# EAGLE design TSAL_Revisado (EAGLE 9.0.1)
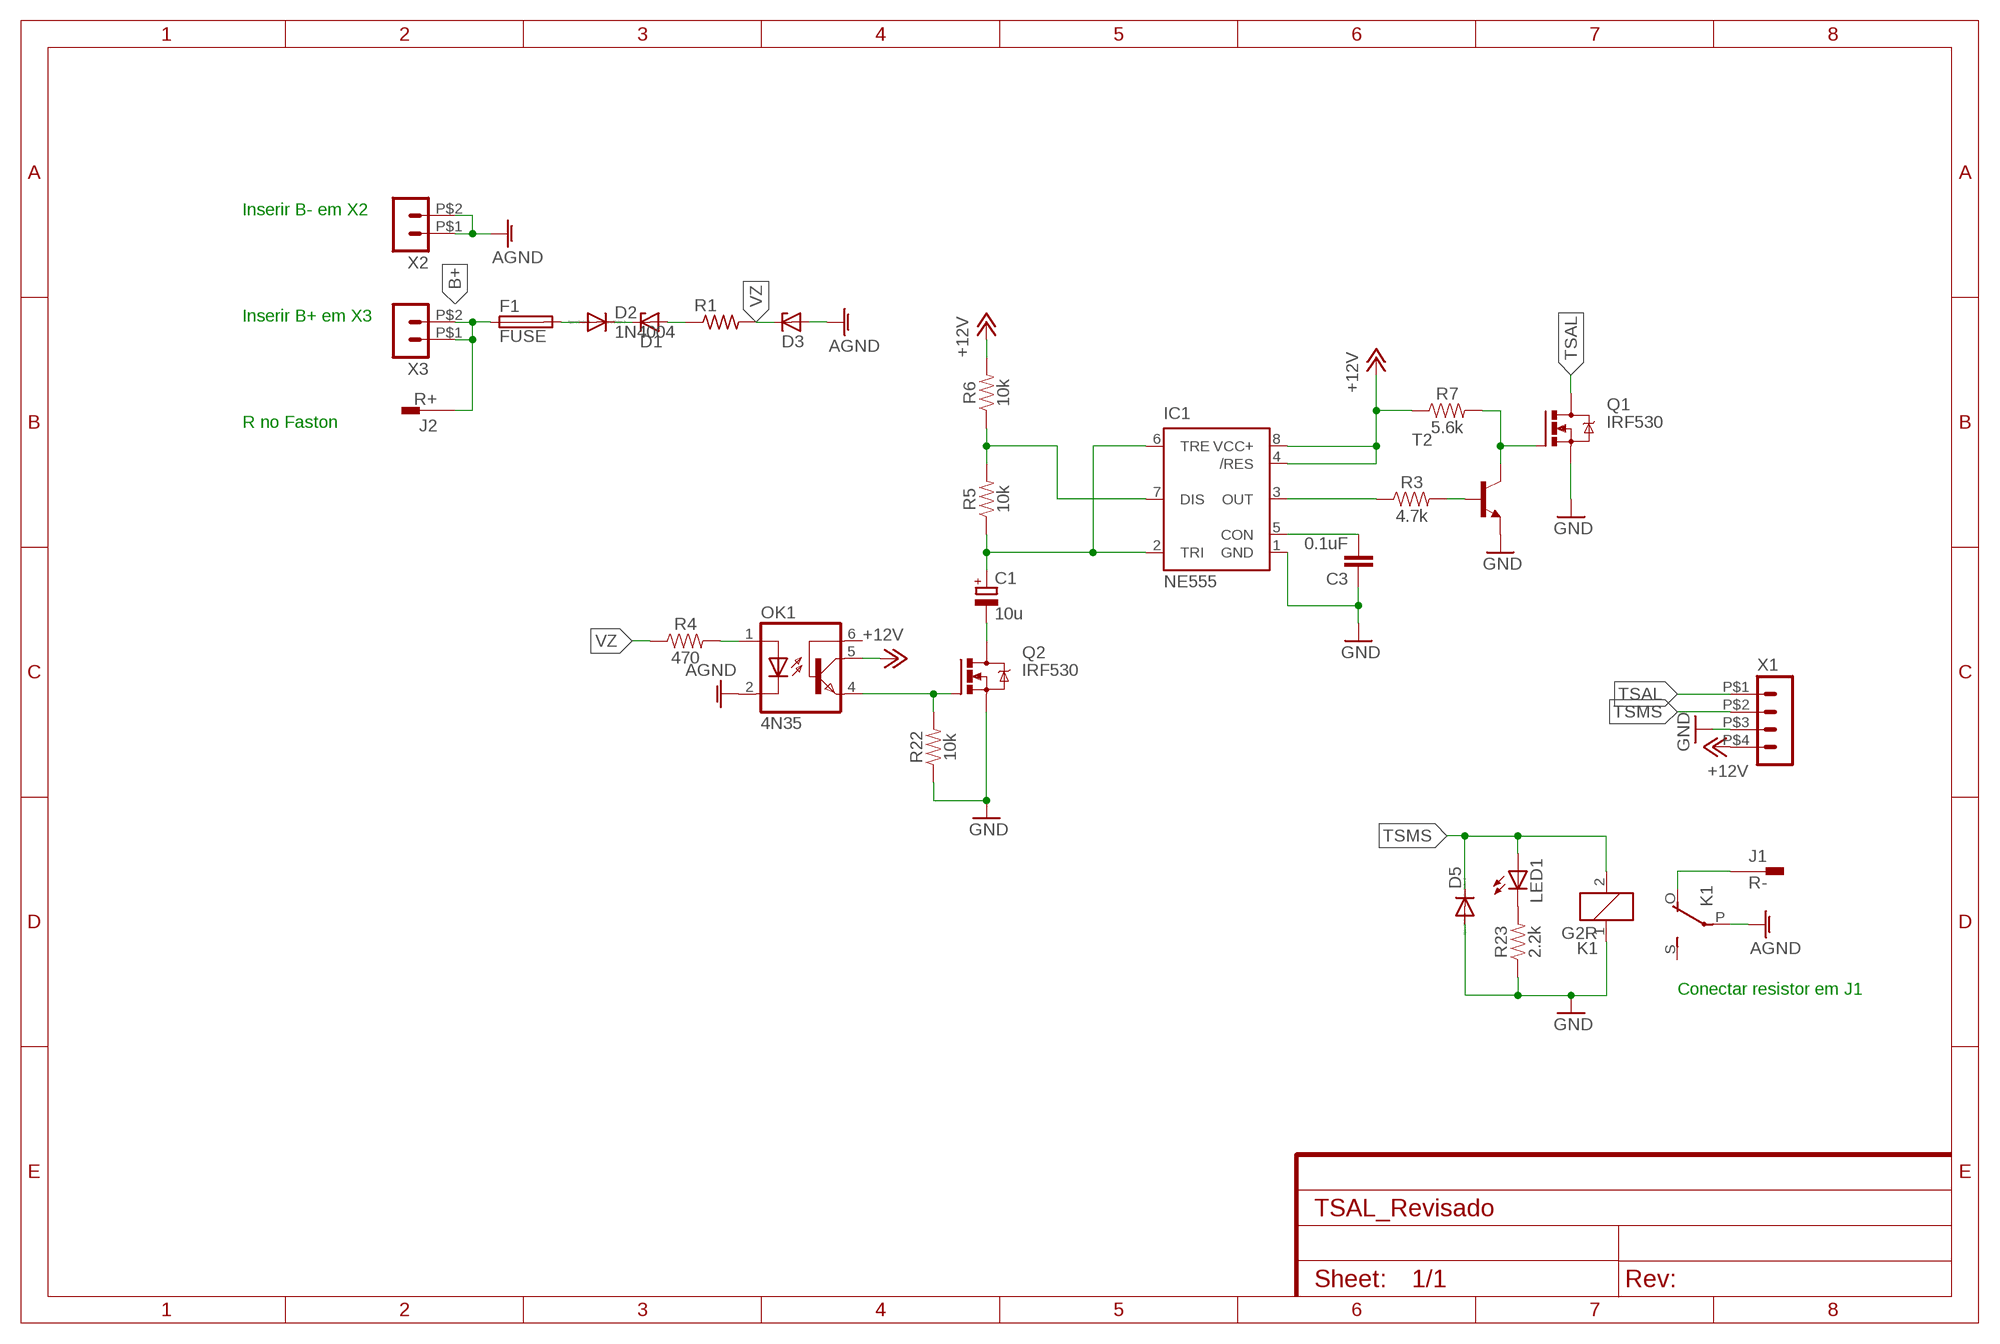
[diagram p0: schematic, sheet 1]
FRAME1 (FRAME-A4L): CNAME: Tractive System Active Light Circuit; CREVISION: 3; DESIGNER: Filipe Cavalcanti

## Parts
C1  10u  CPOL-EUE2-5  [E2-5]
C3  0.1uF  0.1UF-KIT-EZ-50V-20%  [CAP-PTH-SMALL-KIT]
D1  ZENER-DIODEDO41Z10  [DO41Z10]
D2  1N4004  [DO41-10]
D3  ZENER-DIODEDO41Z10  [DO41Z10]
D5  1N4148DO35-10  [DO35-10]
F1  FUSE  FUSEBLANK_5X20MM  [FUSE_HOLDER_5X20MM]
IC1  NE555  [DIL-08]
J1  R-  PIN2F061.080  [F061.080]
J2  R+  PIN2F061.080  [F061.080]
K1  G2R  [G2R]
LED1  LED3MM  [LED3MM]
OK1  4N35  [DIL06]
Q1  IRF530  [TO220BV]
Q2  IRF530  [TO220BV]
R1  R-US_0207/15  [0207/15]
R3  4.7k  RESISTORAXIAL-0.3  [AXIAL-0.3]
R4  470  RESISTORAXIAL-0.3  [AXIAL-0.3]
R5  10k  RESISTORAXIAL-0.3  [AXIAL-0.3]
R6  10k  RESISTORAXIAL-0.3  [AXIAL-0.3]
R7  5.6k  RESISTORAXIAL-0.3  [AXIAL-0.3]
R22  10k  RESISTORAXIAL-0.3  [AXIAL-0.3]
R23  2.2k  RESISTORAXIAL-0.3  [AXIAL-0.3]
T2  BC337-NPN-TO92-CBE  [TO92-CBE]
X1  HEADER_POS4_43045-0401  [43045-0400]
X2  HEADER_POS2_43650-0200  [43650-0200]
X3  HEADER_POS2_43650-0200  [43650-0200]

## Nets
+12V: IC1.4(/RES) IC1.8(VCC+) OK1.5(COL) R6.P$2 R7.P$1 X1.P$4
AGND: D3.A K1.P(2:P) OK1.2(C) X2.P$1 X2.P$2
B+: F1.1 J2.1A J2.1B X3.P$1 X3.P$2
GND: C3.1 D5.A IC1.1(GND) K1.1 Q1.S Q2.S R22.P$1 R23.P$1 T2.E X1.P$3
N$1: D1.A R1.1
N$2: D2.A F1.2
N$3: J1.1A J1.1B K1.O(2:O)
N$4: C3.2 IC1.5(CON)
N$6: OK1.1(A) R4.P$2
N$8: IC1.3(OUT) R3.P$1
N$9: R3.P$2 T2.B
N$10: C1.+ IC1.2(TRI) IC1.6(TRE) R5.P$1
N$11: Q1.G R7.P$2 T2.C
N$12: IC1.7(DIS) R5.P$2 R6.P$1
N$25: D1.C D2.C
N$27: C1.- Q2.D
N$28: OK1.4(EMI) Q2.G R22.P$2
N$30: LED1.K(C) R23.P$2
TSAL: Q1.D X1.P$1
TSMS: D5.C K1.2 LED1.A X1.P$2
VZ: D3.C R1.2 R4.P$1
Unconnected: K1.S(2:S) OK1.6(BAS)

## Notes on the sheet
- Inserir B- em X2
- Inserir B+ em X3
- R no Faston
- Conectar resistor em J1

## Library data of the parts
C1 = rcl:CPOL-EU: POLARIZED CAPACITOR, European symbol; SPICEPREFIX: C
C3 = SparkFun-Capacitors:0.1UF: 0.1µF ceramic capacitors A capacitor is a passive two-terminal electrical component used to store electrical energy temporarily in an electric field.; PROD_ID: CAP-08370
D1 D3 = diode:ZENER-DIODE: Z-Diode
D2 = diode:1N4004: DIODE general purpose rectifier, 1 A
D5 = diode:1N4148: DIODE high speed (Philips)
F1 = fuse:FUSE: Fuse; OC_FARNELL: unknown; OC_NEWARK: unknown
IC1 = st-microelectronics:NE555: General purpose bipolar Timer; MF: Arrow Electronics; MPN: NE555N; OC_FARNELL: 1467742; OC_NEWARK: 89K1486
J1 J2 = con-faston:PIN2: Flachstecker Typ Tyco/Electronics/AMP TAB, FASTON Printed Circuit Board Tabs Source: http://www.buerklin.com, http://catalog.tycoelectronics.com; OC_FARNELL: unknown; OC_NEWARK: unknown
K1 = relay:G2R: RELAY 1 x switch, Omron; OC_FARNELL: 1569185; OC_NEWARK: unknown
LED1 = led:LED: LED OSRAM: - CHIPLED LG R971, LG N971, LY N971, LG Q971, LY Q971, LO R971, LY R971 LH N974, LH R974 LS Q976, LO Q976, LY Q976 LO Q996 - Hyper CHIPLED LW Q18S LB Q993, LB Q99A, LB R99A - SideLED LS A670, LO A670, LY A670, LG A670, LP A670 LB A673, LV A673, LT A673, LW A673 LH A674 LY A675 LS A676, LA A676, LO A676, LY A676, LW A676 LS A679, LY A679, LG A679 - Hyper Micro SIDELED® LS Y876, LA Y876, LO Y876, LY Y876 LT Y87S - SmartLED LW L88C, LW L88S LB L89C, LB L89S, LG L890 LS L89K, LO L89K, LY L89K LS L896, LA L896, LO L896, LY L896 - TOPLED LS T670, LO T670, LY T670, LG T670, LP T670 LSG T670, LSP T670, LSY T670, LOP T670, LYG T670 LG T671, LOG T671, LSG T671 LB T673, LV T673, LT T673, LW T673 LH T674 LS T676, LA T676, LO T676, LY T676, LB T676, LH T676, LSB T676, LW T676 LB T67C, LV T67C, LT T67C, LS T67K, LO T67K, LY T67K, LW E67C LS E67B, LA E67B, LO E67B, LY E67B, LB E67C, LV E67C, LT E67C LW T67C LS T679, LY T679, LG T679 LS T770, LO T770, LY T770, LG T770, LP T770 LB T773, LV T773, LT T773, LW T773 LH T774 LS E675, LA E675, LY E675, LS T675 LS T776, LA T776, LO T776, LY T776, LB T776 LHGB T686 LT T68C, LB T68C - Hyper Mini TOPLED® LB M676 - Mini TOPLED Santana® LG M470 LS M47K, LO M47K, LY M47K Source: http://www.osram.convergy.de LUXEON: - LUMILED® LXK2-PW12-R00, LXK2-PW12-S00, LXK2-PW14-U00, LXK2-PW14-V00 LXK2-PM12-R00, LXK2-PM12-S00, LXK2-PM14-U00 LXK2-PE12-Q00, LXK2-PE12-R00, LXK2-PE12-S00, LXK2-PE14-T00, LXK2-PE14-U00 LXK2-PB12-K00, LXK2-PB12-L00, LXK2-PB12-M00, LXK2-PB14-N00, LXK2-PB14-P00, LXK2-PB14-Q00 LXK2-PR12-L00, LXK2-PR12-M00, LXK2-PR14-Q00, LXK2-PR14-R00 LXK2-PD12-Q00, LXK2-PD12-R00, LXK2-PD12-S00 LXK2-PH12-R00, LXK2-PH12-S00 LXK2-PL12-P00, LXK2-PL12-Q00, LXK2-PL12-R00 Source: www.luxeon.com KINGBRIGHT: KA-3528ASYC Source: www.kingbright.com
OK1 = optocoupler:4N35: MOTOROLA OPTO COUPLER; MF: FAIRCHILD SEMICONDUCTOR; MPN: 4N35; OC_FARNELL: 1328375; OC_NEWARK: 72K9946
Q1 Q2 = transistor-power:IRF530: HEXFET Power MOSFET
R1 = resistor:R-US_: RESISTOR, American symbol
R3-R7 R22 R23 = SparkFun-Resistors:RESISTOR: Generic Resistor Package
T2 = transistor:*-NPN-: NPN Transistror BF959 corrected 2008.03.06
X1 = con-molex-micro-fit-3_0:HEADER_POS4_?: Molex - Micro-Fit 3.0 Series connector, 3.00mm (0.118") pitch header, 4 positions.
X2 X3 = con-molex-micro-fit-3_0:HEADER_POS2_?: Molex - Micro-Fit 3.0 Series connector, 3.00mm (0.118") pitch header, 2 positions.

## Board
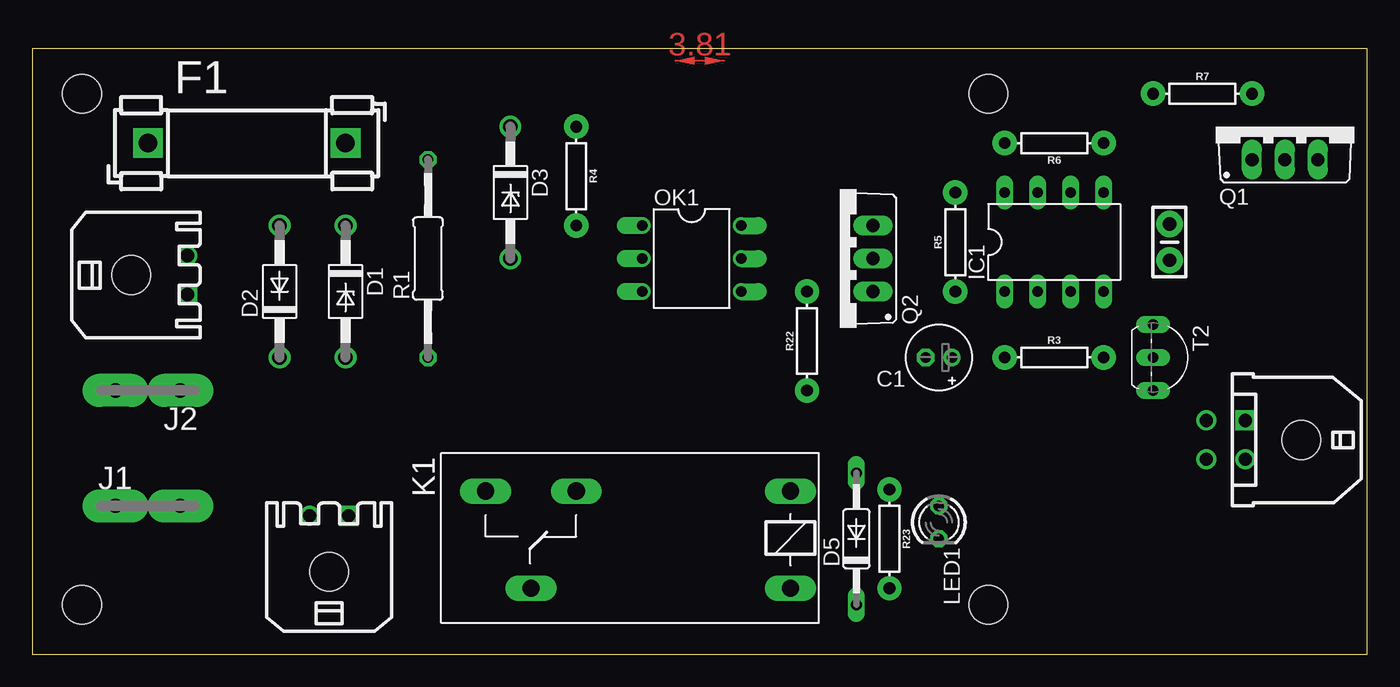
[diagram p1: board, top side]
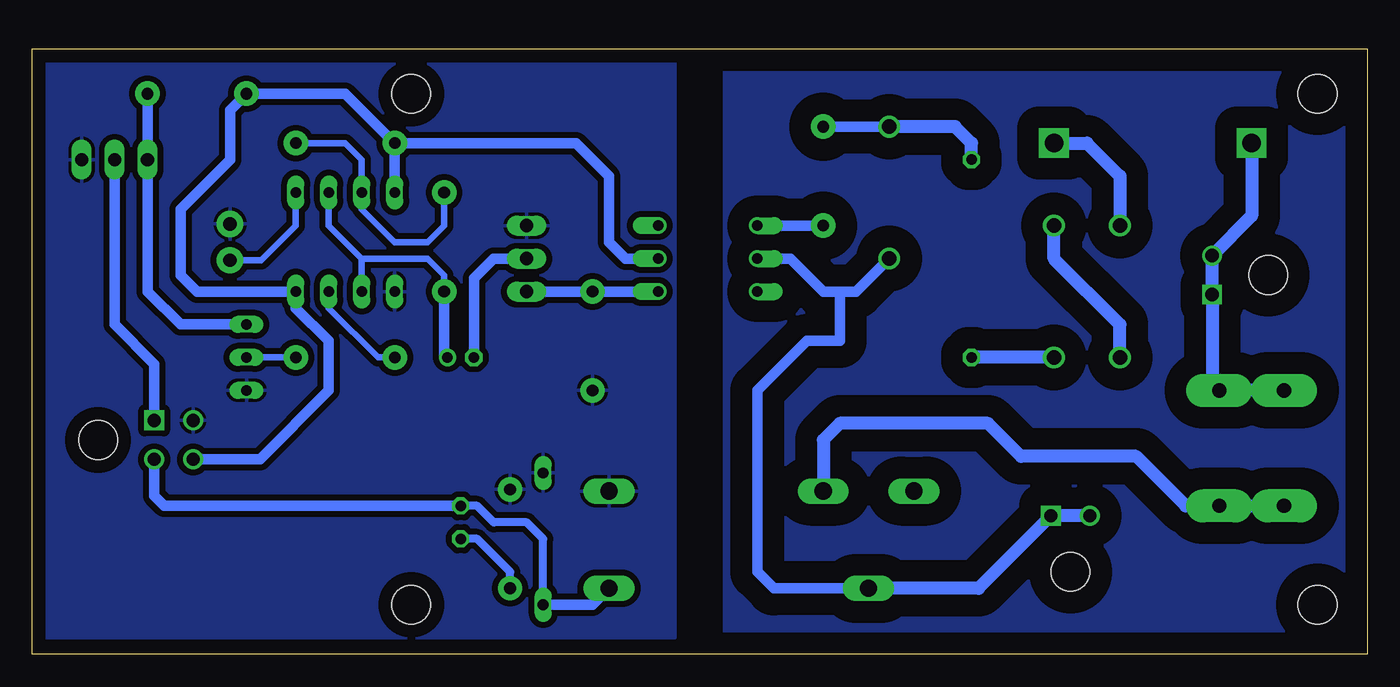
[diagram p2: board, bottom side, seen from below]

Size 102.85 x 46.66 mm. Coordinates in mm from the lower left corner, seen from the top.
Outline: 0,0 102.85,0 102.85,46.66 0,46.66 0,0
Copper layers (1*16): Top 0.035mm / dielectric 1.5mm / Bottom 0.035mm
Design rules "default": minimum track width 6mil, minimum drill 0.35mm, track to track 6mil, track to pad 6mil, pad to pad 6mil, via to via 6mil, smd to smd 6mil, copper to edge 40mil, drill to drill 6mil, minimum pad ring 10mil, minimum via ring 8mil, stop-mask expansion 4mil, vias tented up to drill 0mil, thermal gap 10mil
Holes 3 mm at 3.81,43.18 3.81,3.81 73.66,43.18 73.66,3.81

### Footprints (pad centres in the part's own frame; a part is rotated, then mirrored left to right if it is on the bottom)
E2-5 = drill 0.813 pad 1.27: + -1.016,0 | drill 0.813 pad 1.27 octagon: - 1.016,0
CAP-PTH-SMALL-KIT = drill 1.016 pad 2.032: 1 -1.397,0; 2 1.397,0
DO41Z10 = drill 1.118: A 5.08,0; C -5.08,0
DO41-10 = drill 1.118: A 5.08,0; C -5.08,0
DO35-10 = drill 0.813 long: A 5.08,0; C -5.08,0
FUSE_HOLDER_5X20MM = drill 1.422 pad 2.286 square: 1 0,0; 2 15.24,0
DIL-08 = drill 0.813 long: 1 -3.81,-3.81; 2 -1.27,-3.81; 3 1.27,-3.81; 4 3.81,-3.81; 5 3.81,3.81; 6 1.27,3.81; 7 -1.27,3.81; 8 -3.81,3.81
F061.080 = drill 1.1 pad 2.54 long: 1A -2.5,0; 1B 2.5,0
G2R = drill 1.321 long: 1 -2.54,-3.683; 2 -2.54,3.81; O 13.97,-3.683; P 17.45,3.81; S 20.955,-3.683
LED3MM = drill 0.813 octagon: A -1.27,0; K 1.27,0
DIL06 = drill 0.813 offset: 1 -2.54,-3.81; 2 0,-3.81; 3 2.54,-3.81; 4 2.54,3.81; 5 0,3.81; 6 -2.54,3.81
TO220BV = drill 1.016 long: D 0,-2.54; G -2.54,-2.54; S 2.54,-2.54
0207/15 = drill 0.813 octagon: 1 -7.62,0; 2 7.62,0
AXIAL-0.3 = drill 0.9 pad 1.88: P$1 -3.81,0; P$2 3.81,0
TO92-CBE = drill 0.813 long: B 0,0; C -2.54,0; E 2.54,0
43045-0400 = drill 1.02 square: P$1 1.5,4.32 | drill 1.02: P$2 -1.5,4.32; P$3 1.5,7.32; P$4 -1.5,7.32 | hole 3: 0,0
43650-0200 = drill 1.02 square: P$1 1.5,4.32 | drill 1.02: P$2 -1.5,4.32 | hole 3: 0,0

### Placement (x,y rotation side)
C1  69.85,22.86 180 top
C3  87.63,31.75 270 top
D1  24.13,27.94 270 top
D2  19.05,27.94 90 top
D3  36.83,35.56 270 top
D5  63.5,8.89 90 top
F1  8.89,39.37 0 top
IC1  78.74,31.75 0 top
J1  8.89,11.43 0 top
J2  8.89,20.32 180 top
K1  55.88,8.89 180 top
LED1  69.85,10.16 270 top
OK1  50.8,30.48 270 top
Q1  96.52,40.64 0 top
Q2  62.23,30.48 90 top
R1  30.48,30.48 90 top
R3  78.74,22.86 0 top
R4  41.91,36.83 270 top
R5  71.12,31.75 90 top
R6  78.74,39.37 180 top
R7  90.17,43.18 0 top
R22  59.69,24.13 90 top
R23  66.04,8.89 270 top
T2  86.36,22.86 270 top
X1  97.79,16.51 90 top
X2  22.86,6.35 0 top
X3  7.62,29.21 270 top

### Tracks (layer width: path | path; a pad name or v marks a point on that pad's centre or on a via)
+12V
  Bottom 0.813: IC1.8 R6.P$2 | R6.P$2 60.96,39.37 58.42,36.83 58.42,31.75 57.15,30.48 OK1.5 | R6.P$2 78.74,43.18 R7.P$1 87.63,41.91 87.63,38.1 91.44,34.29 91.44,29.21 90.17,27.94 IC1.4 82.55,26.67 80.01,24.13 80.01,20.32 85.32,15.01 X1.P$4
AGND
  Bottom 0.813: 40.64,27.94 41.91,27.94 44.45,30.48 OK1.2 | 40.64,27.94 40.64,24.13 43.18,24.13 46.99,20.32 46.99,6.35 45.72,5.08 K1.P | D3.A 39.37,27.94 40.64,27.94
  Bottom 1.016: X2.P$2 X2.P$1 29.95,5.08 K1.P
B+
  Bottom 1.016: J2.1B J2.1A 11.94,20.72 X3.P$1 X3.P$2 8.89,33.76 F1.1
GND
  pour Bottom (isolate 0.457): 53.34,1.27 53.34,45.72 102.87,45.72 102.87,1.27
N$1
  Bottom 1.016: D1.A R1.1
N$2
  Bottom 1.016: F1.2 21.59,39.37 19.05,36.83 D2.A
N$3
  Bottom 1.016: K1.O 41.91,16.51 40.64,17.78 29.21,17.78 26.67,15.24 17.78,15.24 13.97,11.43 J1.1B J1.1A
N$4
  Bottom 0.508: C3.2 85.22,30.35 82.55,33.02 IC1.5
N$6
  Bottom 0.813: R4.P$2 OK1.1
N$8
  Bottom 0.508: IC1.3 80.01,26.67 76.2,22.86 R3.P$1
N$9
  Bottom 0.508: R3.P$2 T2.B
N$10
  Bottom 0.508: IC1.2 77.47,30.48 | 77.47,30.48 80.01,33.02 IC1.6 | 77.47,30.48 72.39,30.48 71.12,29.21 R5.P$1
  Bottom 0.813: C1.+ 71.12,23.11 R5.P$1
N$11
  Bottom 0.813: T2.C 91.44,25.4 93.98,27.94 Q1.G R7.P$2
N$12
  Bottom 0.508: R6.P$1 78.74,39.37 77.47,38.1 IC1.7 77.47,34.29 74.93,31.75 72.39,31.75 71.12,33.02 R5.P$2
N$13
  pour Bottom (isolate 1.676): 49.53,45.72 0,45.72 0,1.27 49.53,1.27
N$25
  Bottom 1.016: D1.C 24.13,30.48 19.05,25.4 D2.C
N$27
  Bottom 0.813: Q2.D 67.31,30.48 68.83,28.96 C1.-
N$28
  Bottom 0.813: OK1.4 R22.P$2 Q2.G
N$30
  Bottom 0.61: R23.P$2 66.04,6.35 68.58,8.89 LED1.K
TSAL
  Bottom 0.813: X1.P$1 93.47,22.35 96.52,25.4 Q1.D
TSMS
  Bottom 0.61: D5.C 63.5,8.89 64.77,10.16 67.31,10.16 68.58,11.43 LED1.A
  Bottom 0.813: X1.P$2 93.47,12.19 92.71,11.43 LED1.A | K1.2 59.69,3.81 D5.C
VZ
  Bottom 0.813: D3.C R4.P$1
  Bottom 1.016: R1.2 30.48,39.37 31.75,40.64 D3.C
(copper drawn outside any net)
  shapes: Top area x1